# Altium schematic sheet Sheet1.SchDoc
size 381 x 241 mm; SheetNumber: 1; SheetTotal: 1
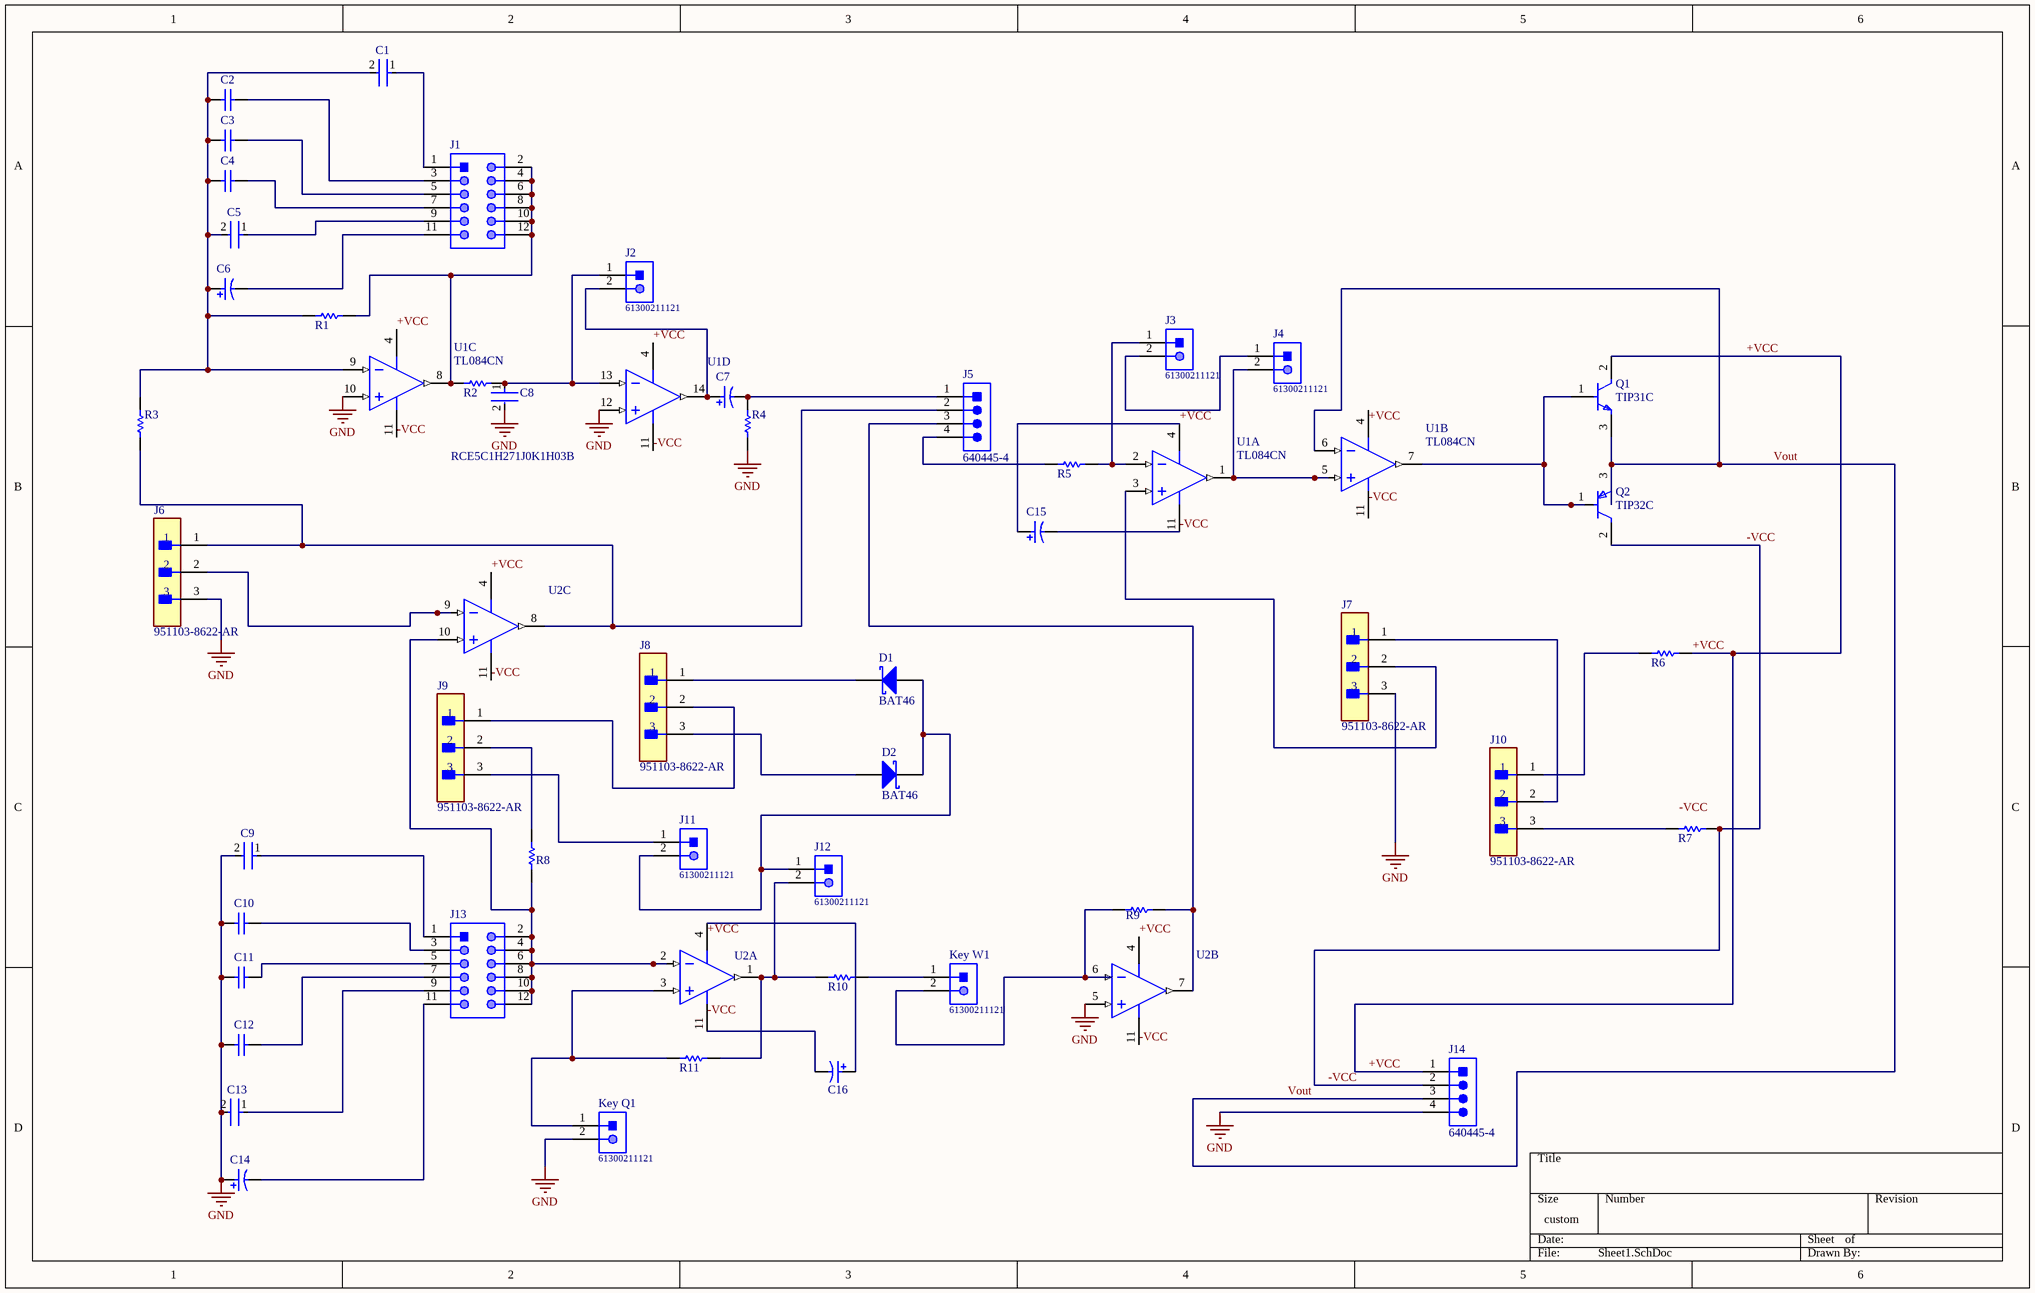
[diagram p0: Sheet1.SchDoc]

## Parts
C1  RCE5C1H101J0DBH03A  [FP-RCE0DB-MFG]  (value not drawn)
C2  C315C102K1R5TA  [KEMT-C315-THT-2]  (value not drawn)
C3  C315C103K1R5TA  [KEMT-C315-THT-2]  (value not drawn)
C4  C320C104K5R5TA  [CAPR51-254-508X318X736]  (value not drawn)
C5  K105Z20Y5VF5TL2  [FP-K105Z20Y5VF5TL2-MFG]  (value not drawn)
C6  ECA1HM100  [CAPPR55-200-1100X500X1200]  (value not drawn)
C7  ECA1HM100  [CAPPR55-200-1100X500X1200]  (value not drawn)
C8  RCE5C1H271J0K1H03B  [FP-RCE0K1-MFG]
C9  RCE5C1H101J0DBH03A  [FP-RCE0DB-MFG]  (value not drawn)
C10  C315C102K1R5TA  [KEMT-C315-THT-2]  (value not drawn)
C11  C315C103K1R5TA  [KEMT-C315-THT-2]  (value not drawn)
C12  C320C104K5R5TA  [CAPR51-254-508X318X736]  (value not drawn)
C13  K105Z20Y5VF5TL2  [FP-K105Z20Y5VF5TL2-MFG]  (value not drawn)
C14  ECA1HM100  [CAPPR55-200-1100X500X1200]  (value not drawn)
C15  ECA1HM100  [CAPPR55-200-1100X500X1200]  (value not drawn)
C16  ECA1HM100  [CAPPR55-200-1100X500X1200]  (value not drawn)
D1  BAT46  [STM-DO-35-2]
D2  BAT46  [STM-DO-35-2]
J1  61301221021  [61301221021]  (value not drawn)
J2  61300211121  [61300211121]
J3  61300211121  [61300211121]
J4  61300211121  [61300211121]
J5  640445-4  [TECO-640445-4_V]
J6  951103-8622-AR  [FP-951103-8622-AR-MFG]
J7  951103-8622-AR  [FP-951103-8622-AR-MFG]
J8  951103-8622-AR  [FP-951103-8622-AR-MFG]
J9  951103-8622-AR  [FP-951103-8622-AR-MFG]
J10  951103-8622-AR  [FP-951103-8622-AR-MFG]
J11  61300211121  [61300211121]
J12  61300211121  [61300211121]
J13  61301221021  [61301221021]  (value not drawn)
J14  640445-4  [TECO-640445-4_V]
Key_Q1  61300211121  [61300211121]
Key_W1  61300211121  [61300211121]
Q1  TIP31C  [FP-TO-220-P0A0015988-MFG]
Q2  TIP32C  [FP-TO-220-P0A0015988-MFG]
R1  MFR-25FBF52-100K  [RESA60-630X240]  (value not drawn)
R2  MFR-25FBF52-1K  [RESA60-630X240]  (value not drawn)
R3  MFR-25FBF52-100K  [RESA60-630X240]  (value not drawn)
R4  MFR-25FBF52-100K  [RESA60-630X240]  (value not drawn)
R5  MFR-25FBF52-100K  [RESA60-630X240]  (value not drawn)
R6  MFR-25FBF52-100K  [RESA60-630X240]  (value not drawn)
R7  MFR-25FBF52-100K  [RESA60-630X240]  (value not drawn)
R8  MFR-25FBF52-1K  [RESA60-630X240]  (value not drawn)
R9  MFR-25FBF52-1K  [RESA60-630X240]  (value not drawn)
R10  MFR-25FBF52-100K  [RESA60-630X240]  (value not drawn)
R11  MFR-25FBF52-100K  [RESA60-630X240]  (value not drawn)
U1  TL084CN  [N0014A]  (parts A,B,C,D of 4)
U2  TL084CN  [N0014A]  (value not drawn)  (parts A,B,C of 4)

## Nets
GND: C8.2 C9.2 C10.1 C11.1 C12.1 C13.2 C14.1 J6.3 J7.3 J14.4 Key_Q1.2 R4.1 U1.10(IN3+) U1.12(IN4+) U2.5(IN2+)
+VCC: C15.1 J14.1 Q1.2(C) R6.1 U1.4(VCC+) U2.4(VCC+)
-VCC: C15.2 J14.2 Q2.2(C) R7.1 U1.11(VCC-) U2.11(VCC-)
Vout: J14.3 Q1.3(E) Q2.3(E) U1.6(IN2-)
NetC1_1: C1.1 J1.1
NetC1_2: C1.2 C2.1 C3.1 C4.1 C5.2 C6.1 R1.2 R3.2 U1.9(IN3-)
NetC2_2: C2.2 J1.3
NetC3_2: C3.2 J1.5
NetC4_2: C4.2 J1.7
NetC5_1: C5.1 J1.9
NetC6_2: C6.2 J1.11
NetC7_1: C7.1 J2.2 U1.14(OUT4)
NetC7_2: C7.2 J5.1 R4.2
NetC8_1: C8.1 J2.1 R2.1 U1.13(IN4-)
NetC9_1: C9.1 J13.1
NetC10_2: C10.2 J13.3
NetC11_2: C11.2 J13.5
NetC12_2: C12.2 J13.7
NetC13_1: C13.1 J13.9
NetC14_2: C14.2 J13.11
NetC16_1: C16.1 U2.4(VCC+)
NetC16_2: C16.2 U2.11(VCC-)
NetD1_1: D1.1(A) D2.2(K) J11.2 J12.1
NetD1_2: D1.2(K) J8.1
NetD2_1: D2.1(A) J8.3
NetJ1_2: J1.2 J1.4 J1.6 J1.8 J1.10 J1.12 R1.1 R2.2 U1.8(OUT3)
NetJ3_1: J3.1 R5.1 U1.2(IN1-)
NetJ3_2: J3.2 J4.1
NetJ4_2: J4.2 U1.1(OUT1) U1.5(IN2+)
NetJ5_2: J5.2 J6.1 R3.1 U2.8(OUT3)
NetJ5_3: J5.3 R9.2 U2.7(OUT2)
NetJ5_4: J5.4 R5.2
NetJ6_2: J6.2 U2.9(IN3-)
NetJ7_1: J7.1 J10.2
NetJ7_2: J7.2 U1.3(IN1+)
NetJ8_2: J8.2 J9.1
NetJ9_2: J9.2 R8.1
NetJ9_3: J9.3 J11.1
NetJ10_1: J10.1 R6.2
NetJ10_3: J10.3 R7.2
NetJ12_2: J12.2 R10.2 R11.1 U2.1(OUT1)
NetJ13_2: J13.2 J13.4 J13.6 J13.8 J13.10 J13.12 R8.2 U2.2(IN1-) U2.10(IN3+)
NetKey_Q1_1: Key_Q1.1 R11.2 U2.3(IN1+)
NetKey_W1_1: Key_W1.1 R10.1
NetKey_W1_2: Key_W1.2 R9.1 U2.6(IN2-)
NetQ1_1: Q1.1(B) Q2.1(B) U1.7(OUT2)

## Notes on the sheet
- Labels drawn without touching a wire or pin: +VCC, -VCC

## Library data of the parts
C1 C9 = CMP-06035-041850-1: Cap Ceramic 100pF 50V C0G ±5% Radial 2.5mm +125°C Ammo Pack; Lead/Base Style: Straight; Lead Diameter: 0.5mm; Height: 3.5mm; Ratings: AEC-Q200; Case/Package: Radial; Termination: Radial; Height - Seated (Max): 0.138inch; Package Quantity: 2000; Tolerance: 5%; Min Operating Temperature: -55°C; Mount: Through Hole; Packaging: Tape and Reel; Dielectric: C0G; Voltage Rating: 50V; Max Operating Temperature: 125°C; Resistor Type: Ceramic; Width: 0.098inch; Length: 0.142inch; Capacitance: 100pF; Lead Pitch: 0.098inch; Voltage Rating (DC): 50V
C2 C10 = CMP-1664-00010-1: Capacitor, Ceramic, 1000 pF, +/-10 %, 100 V, X7R, -55 to 125 degC, 2-Pin THD, RoHS, Bulk; Max Supply Voltage: 3.6 V; Case\Package: DFN; Nominal Supply Voltage: 3 V; Min Supply Voltage: 1.5 V; Interface: Serial; ComponentLink1Description: Manufacturer URL; ComponentLink1URL: http://www.kemet.com/; DatasheetVersion: Aug-16; Max Operating Temperature: 125 degC; REACH SVHC: Unknown; Min Operating Temperature: -40 degC; Radiation Hardening: No; Mount: Surface Mount; Packaging: Tape and Reel; PackageDescription: 2-Pin Through Hole Device, Body 3.81 x 2.54 mm; RoHSCompliant: true; PackageReference: C315-THT-2; ComponentLink2URL: http://capacitoredge.kemet.com/capedge2/DataSheet/Datasheet-C315C102K1R5TA.pdf?pn=C315C102K1R5TA{BULK}; ComponentLink2Description: Datasheet; Pins: 6
C3 C11 = CMP-1664-00007-1: Capacitor, Ceramic, 0.01 uF, +/- 10%, 100 V, X7R, -55 to 125 degC, 2-Pin THD, RoHS, Bulk; Output Voltage: 70 V; Case\Package: PDIP; Forward Current: 60 mA; Nominal Vf: 1.3 V; Forward Voltage: 1.5 V; Channels: 2; Max Power Dissipation: 400 mW; Vce Max: 500 mV; ComponentLink1Description: Manufacturer URL; ComponentLink2Description: Datasheet; Packaging: Rail/Tube; RoHSCompliant: true; Package Quantity: 2000; PackageReference: C315-THT-2; Min Operating Temperature: -55 degC; Max Operating Temperature: 100 degC; Radiation Hardening: No; ComponentLink1URL: http://www.kemet.com/; DatasheetVersion: Aug-16; Pins: 16; PackageDescription: 2-Pin Through Hole Device, Body 3.81 x 2.54 mm; REACH SVHC: Unknown; Mount: Through Hole; ComponentLink2URL: http://capacitoredge.kemet.com/capedge2/DataSheet/Datasheet-C315C103K1R5TA.pdf?pn=C315C103K1R5TA{BULK}
C4 C12 = CMP-1664-00004-1: Radial Leaded Multilayer Ceramic Capacitor, 0.1 uF, +/- 10%, 50 V, -55 to 125 degC, 2-Pin THD, RoHS, Tape and Reel; Case\Package: SOT-23-5; Max Power Dissipation: 250 mW; Output Current: 150 mA; Dropout Voltage: 260 mV; Outputs: 1; Output Voltage: 5 V; Max Input Voltage: 8 V; Min Operating Temperature: -40 degC; Packaging: Tape and Reel; Height: 1.3 mm; Radiation Hardening: No; Pins: 5; ComponentLink1Description: Manufacturer URL; Mount: Surface Mount; RoHSCompliant: true; Max Operating Temperature: 85 degC; PackageReference: CAPR51-254-508X318X736; ComponentLink2URL: http://www.kemet.com/docfinder?Partnumber=C320C104K5R5TA; PackageDescription: 2-Pin Through Hole Device, Body 5.08 x 3.18 mm, Pitch 2.54 mm; ComponentLink1URL: http://www.kemet.com/; Width: 1.8 mm; Package Quantity: 3000; DatasheetVersion: Dec-15; Length: 3 mm; ComponentLink2Description: Datasheet
C5 C13 = CMP-02417-000003-1: CAP CER 1UF 50V Y5V RADIAL; Manufacturer: Vishay BC Components; Tolerance: -20+80%; Material: Ceramic; Capacitance: 1uF; Temperature Characteristic: Y5V; Mouser Description: Multilayer Ceramic Capacitors MLCC - Leaded 1uF 50volts +80/-20% Y5V 2.5mm LS; Lead Free: Yes; RoHS: TRUE; Voltage Rating: 50V; Device Class L1: Passive Components; Octopart: https://octopart.com/k105z20y5vf5tl2-vishay-39475252; Temperature Range Low: -30°C; Digikey Description: CAP CER 1UF 50V Y5V RADIAL; Manufacturer Part Number: K105Z20Y5VF5TL2; Device Class L2: Capacitors; Temperature: -30°C to +85°C; Package: K105Z20Y5VF5TL2; Temperature Range High: +85°C; ComponentLink2Description: Datasheet; Value: 1uF; Category: Cap; Height: 6.6mm; ComponentLink2URL: https://www.vishay.com/docs/45171/kseries.pdf; Device Class L3: Ceramic Capacitors; Automotive: No
C6 C7 C14-C16 = CMP-1665-00038-2: Aluminum Electrolytic Capacitor, 10 uF, +/- 20%, 50 V, -40 to 85 degC, 2-Pin THD, RoHS, Bulk; Manufacturer: Panasonic; Life (Hours): 2000Hour; Lead/Base Style: Straight; Dissipation Factor: 0.12%; Capacitance: 10uF; Leakage Current: 3uA; Dielectric Material: Aluminium; Lead Diameter: 0.5mm; Voltage Rating: 50V; Ripple Current: 65mA; Package Reference: CAPPR55-200-1100X500X1200; Height: 11mm; Diameter: 5mm; REACH SVHC: NoSVHC; Mount: ThroughHole; Packaging: Bulk; Manufacturer URL: http://www.panasonic.com/; Termination: Radial; Datasheet URL: https://industrial.panasonic.com/cdbs/www-data/pdf/RDF0000/ABA0000C1218.pdf; Lead Free: LeadFree; Height - Seated (Max): 0.472inch; Case/Package: Radial; Package Description: 2-Pin Radial Lead, Dia 5 mm, Height 12 mm; Tolerance: 20%; Datasheet Version: Rev. 05, 10/2016; Package Quantity: 200; Ripple Current (AC): 65mA; Min Operating Temperature: -40degC; RoHSCompliant: true; Number of Pins: 2; Max Operating Temperature: 85degC; Voltage: 50V; Lead Pitch: 2mm; Radiation Hardening: No; Voltage Rating (DC): 50V; Length: 11mm
C8 = CMP-06035-042310-1: Cap Ceramic 270pF 50V C0G ±5% Radial 5mm +125°C Automotive Bulk; Lead Diameter: 0.5mm; Lead/Base Style: Formed Leads; Height: 3.5mm; Max Operating Temperature: 125°C; Length: 0.142inch; Tolerance: 5%; Lead Pitch: 0.197inch; Mount: Through Hole; Width: 2.5mm; Dielectric: C0G; Packaging: Bulk; Voltage Rating: 50V; Resistor Type: Ceramic; Capacitance: 270pF; Case/Package: Radial; Height - Seated (Max): 0.138inch; Package Quantity: 500; Min Operating Temperature: -55°C; Voltage Rating (DC): 50V; Ratings: AEC-Q200; Termination: Radial
D1 D2 = CMP-2000-05926-1: Small Signal Schottky Diode, 150 mA, 100 V, -65 to 125 degC, 2-Pin DO-35, RoHS, Tape and Reel; Manufacturer: STMicroelectronics; SVHC: NoSVHC(15-Jun-2015); Diode Configuration: Single; No. of Pins: 2Pins; Forward Surge Current Ifsm Max: 750mA; Repetitive Reverse Voltage Vrrm Max: 100V; Diode Case Style: DO-204AH; Forward Voltage VF Max: 1V; Forward Current If(AV): 150mA; Manufacturer URL: http://www.st.com/; Packaging: Tape&Reel; Package Reference: DO-35-2; Datasheet URL: http://www.st.com/content/ccc/resource/technical/document/datasheet/group1/11/76/e4/a3/df/07/49/14/CD00000767/files/CD00000767.pdf/jcr:content/translations/en.CD00000767.pdf; Diode Type: Schottky; Mounting Technology: ThroughHole; Package Description: 2-Pin Axial Lead, Dia 1.765 mm, Body Length 3.775 mm; Product Range: -; Datasheet Version: Rev. 2.1, 10/2001; Operating Temperature Max: 125°C
J1 J13 = CMP-1502-01087-1: THT Angled Pin Header WR-PHD, Pitch 2.54 mm, Dual Row, 12 pins; Manufacturer: Wurth Elektronik; Pitch: 2.54mm; Gender: Male; Pin Number: 12; Working Voltage: 250VAC; Withstanding Voltage: 500VAC; Contact Resistance: 20mOhm; Rated Current: 3A; Datasheet URL: https://katalog.we-online.de/em/datasheet/6130xx21021.pdf; Orientation: Angled; Package Reference: 61301221021; Operating Temperature: -40to105degC; Part Number: 61301221021; Mounting Technology: THT; Row Number: Dual; Publisher: WurthElektronik; Packaging: Bag; Manufacturer URL: http://www.we-online.de
J2-J4 J11 J12 Key_Q1 Key_W1 = CMP-1712-00002-4: THT Vertical Pin Header WR-PHD, Pitch 2.54 mm, Single Row, 2 pins; Manufacturer: Wurth Elektronik; Rated Current: 3A; Gender: Male; Withstanding Voltage: 500VAC; Working Voltage: 250VAC; Pitch: 2.54mm; Contact Resistance: 20mOhm; Pin Number: 2; Mounting Technology: THT; Orientation: Vertical; Operating Temperature: -40to105degC; Packaging: Bag; Publisher: WurthElektronik; Datasheet URL: https://katalog.we-online.de/em/datasheet/6130xx11121.pdf; Manufacturer URL: http://www.we-online.de; Row Number: Single; Package Reference: 61300211121; Part Number: 61300211121
J5 J14 = CMP-1684-00016-1: Male Header, Pitch 3.962 mm, 1 x 4 Postion, Height 13.716 mm, Tail Length 3.175 mm, -55 to 105 degC, RoHS; Manufacturer: TE Connectivity; Number of Contacts: 4; Contact Centerline Spacing: 0.156 / in.; Temperature, Operating: -55to+105 / °C; Mount Angle: Vertical; Primary Type: InterconnectSystem; Mounting Hole Size: 0.07 / "; Material, Contact: CopperAlloy; Special Features: IDC,Pinstrip; Agency Approvals: CSA,UL; Voltage, Rating: 600 / V; Pin Spacing: 0.156 / "; Standards: UL94V-0HousingFlammabilityRating,RoHSCompliant,ELVCompliant; Brand/Series: MTA-156Series; Current, Rating: 7 / A; Material, Housing: ThermoplasticPolyester; Angle: Straight; Color, Housing: White; Wire, AWG: 26-18; Package Description: Male Header, Pitch 3.962 mm, 1 x 4 Postion, Height 13.716 mm, Tail Length 3.175 mm; Color: White; Application: Forwire-to-board; Length, Terminal Post: 0.125 / in.; Datasheet Version: Rev. AD5; Manufacturer URL: http://www.te.com; Type: PCBPlug; Number of Positions: 4; Connector Type: Male; Package Reference: THD; Length, Overall: 0.624 / "; Mounting Type: PCBMount; Length, Pin: 0.125 / "; Number of Rows: 1; Flammability Rating: UL94V-0; Termination: Solder; Contact Plating: Tin; Datasheet URL: http://www.te.com/commerce/DocumentDelivery/DDEController?Action=showdoc&DocId=Customer+Drawing%7F640445%7FAD5%7Fpdf%7FEnglish%7FENG_CD_640445_AD5.pdf%7F640445-4; Diameter, Insulation: 0.095"(SingleWire),0.07"(MassTerminationWires)
J6-J10 = CMP-05379-000003-1: CONN HEADER VERT 3POS 2MM; Manufacturer: 3M; Conn Gender: Male; Current Rating: 2A; Number Of Contacts: 3; Conn Orientation: Straight; Digikey Description: CONN HEADER VERT 3POS 2MM; Device Class L3: unset; Category: Conn; Height: 6.3mm; Manufacturer Part Number: 951103-8622-AR; RoHS: TRUE; Contact Material: Gold,Nickel; ComponentLink2Description: Datasheet; Temperature Range Low: -55°C; Device Class L1: Connectors; Pitch: 2mm; Mouser Description: Header; PinStrip; CopperAlloy; HighTempThermoplastic; 3Cnts; 1A; RtAngle; 951Series; Octopart: https://octopart.com/951103-8622-ar-3m-14400669; Package: 951103-8622-AR; Lead Free: Yes; Device Class L2: Headers and Wire Housings; Temperature Range High: +125°C; ComponentLink2URL: http://multimedia.3m.com/mws/media/1400506O/3m-pin-strip-header-951-series-78-5100-2653-3.pdf; Automotive: No; Temperature: -55°C to +125°C; Number Of Rows: 1
Q1 = CMP-12195-000001-1: TRANS NPN 100V 3A TO-220; Manufacturer: STMicroelectronics; Hfe Max: 50; Number Of Npn: 1; Max Junction Temp: +150°C; Standoff Height: 3.5mm; Emitter Base Voltage: 5V; Collector Emitter Saturation Voltage: 1.2V; Power Dissipation: 2W; Hfe Testvce: 4V; Hfe Min: 10; Device Class L2: Transistors; ComponentLink2URL: https://www.st.com/resource/en/datasheet/tip31c.pdf; Device Class L1: Discrete Semiconductors; Digikey Description: TRANS NPN 100V 3A TO-220; Max Collector Current: 3A; RoHS: TRUE; Height: 19.68mm; Mouser Description: Bipolar Transistors - BJT NPN Gen Pur Power; Number Of Elements: 1; Package: TO-220-P0A0015988; Temperature: to +150°C; Octopart: https://octopart.com/tip31c-stmicroelectronics-15555; Manufacturer Part Number: TIP31C; Category: Trans; Hfe Testic: 3A; Lead Free: Yes; Collector Base Voltage: 100V; Device Class L3: BJTs; Collector Emitter Voltage: 100V; Automotive: No; ComponentLink2Description: Datasheet; Temperature Range High: +150°C
Q2 = CMP-12195-000005-1: TRANS PNP 100V 3A TO-220; Manufacturer: STMicroelectronics; Standoff Height: 3.5mm; Number Of Pnp: 1; Max Collector Current: -3A; Emitter Base Voltage: -5V; Collector Emitter Voltage: -100V; Hfe Testvce: -4V; Hfe Max: 50; Collector Emitter Saturation Voltage: -1.2V; Power Dissipation: 2W; Max Junction Temp: +150°C; Hfe Min: 10; Device Class L3: BJTs; Mouser Description: Original ST Microelectronics Transistor, 100V, 3A, .22 Ohm, TO-220 Package; ComponentLink2Description: Datasheet; Device Class L1: Discrete Semiconductors; Automotive: No; Number Of Elements: 1; Category: Trans; Collector Base Voltage: -100V; Package: TO-220-P0A0015988; Height: 19.68mm; Lead Free: Yes; ComponentLink2URL: https://www.st.com/resource/en/datasheet/tip32c.pdf; Hfe Testic: -3A; RoHS: TRUE; Temperature Range High: +150°C; Temperature: to +150°C; Device Class L2: Transistors; Digikey Description: TRANS PNP 100V 3A TO-220; Octopart: https://octopart.com/tip32c-stmicroelectronics-353617; Manufacturer Part Number: TIP32C
R1 R3-R7 R10 R11 = CMP-1659-00073-1: Axial Resistor, 100 KOhm, +/- 1%, 0.25 W, -55 to 155 degC, 2-Pin THD, RoHS, Bulk; Voltage Rating: 250 V; Power Rating: 250 mW; Resistance: 475 Ohm; PackageDescription: 2-Pin Axial Lead, Dia 2.4 mm, Body Length 6.3 mm; PackageReference: MFR-25; Length: 0.248 inch; ComponentLink2Description: Datasheet; Packaging: Bulk; DatasheetVersion: Apr-13; Package Quantity: 200; Min Operating Temperature: -55 degC; ComponentLink2URL: http://www.yageo.com/documents/recent/Yageo%20LR_MFR_2013.pdf; RoHSCompliant: true; ComponentLink1URL: http://www.yageo.com/; Tolerance: 1%; Case\Package: Axial; Mount: Through Hole; ComponentLink1Description: Manufacturer URL; Max Operating Temperature: 155 degC
R2 R8 R9 = CMP-1659-00075-1: Axial Resistor, 1 KOhm, +/- 1%, 250 mW, -55 to 155 degC, 2-Pin THD, RoHS, Bulk; Voltage Rating: 250 V; Resistance: 10 kohm; Power Rating: 250 mW; ComponentLink2Description: Datasheet; RoHSCompliant: true; PackageReference: MFR-25; Case\Package: Axial; Max Operating Temperature: 155 degC; DatasheetVersion: Apr-13; Tolerance: 1%; ComponentLink1URL: http://www.yageo.com/; Length: 0.248 inch; ComponentLink2URL: http://www.yageo.com/documents/recent/Yageo%20LR_MFR_2013.pdf; Packaging: Bulk; Package Quantity: 200; PackageDescription: 2-Pin Axial Lead, Dia 2.4 mm, Body Length 6.3 mm; Min Operating Temperature: -55 degC; ComponentLink1Description: Manufacturer URL
U1 U2 = CMP-0017-00818-2: JFET-Input Operational Amplifier, 7 to 36 V, 0 to 70 degC, 14-pin DIP (N14), Pb-Free (RoHS); Manufacturer: Texas Instruments; Rating: Catalog; Iq per channel(Max)(mA): 2.8; Number of Channels: 4; IIB(Max)(pA): 400; Vio (25C)(Max)(mV): 15; GBW(Typ)(MHz): 3; Total Supply Voltage(Max)(+5V is 5, +/-5V is 10): 36; Vn at 1kHz(Typ)(nV/rtHz): 18; Sub Family: General Purpose Amplifier, High Supply Voltage Amplifier (>=30V); Slew Rate(Typ)(V/us): 13; Total Supply Voltage(Min)(+5V is 5, +/-5V is 10): 7; CMRR(Min)(dB): 70; ComponentLink3Description: Package Specification; PackageDescription: 14-Pin Plastic In-Line, Body 19.305 x 6.35 mm, Pitch 2.54 mm; ComponentLink1Description: Manufacturer URL; PackageVersion: 4040049/E, 12/2002; Eco-Plan: Pb-Free (RoHS); ComponentLink2URL: http://www.ti.com/lit/ds/symlink/tl084.pdf; ComponentLink1URL: http://www.ti.com/; DatasheetVersion: SLOS081G; Mounting Technology: Through Hole; PartNumber: TL084CN; Offset Drift(Typ)(uV/C): 18; PackageReference: N0014A; ComponentLink3URL: http://www.ti.com/lit/ml/mpdi002c/mpdi002c.pdf; ComponentLink2Description: Datasheet; Code_JEDEC: MS-001